# EAGLE schematic NS_ARM_Control_07_17_2017 (EAGLE 6.6.0)
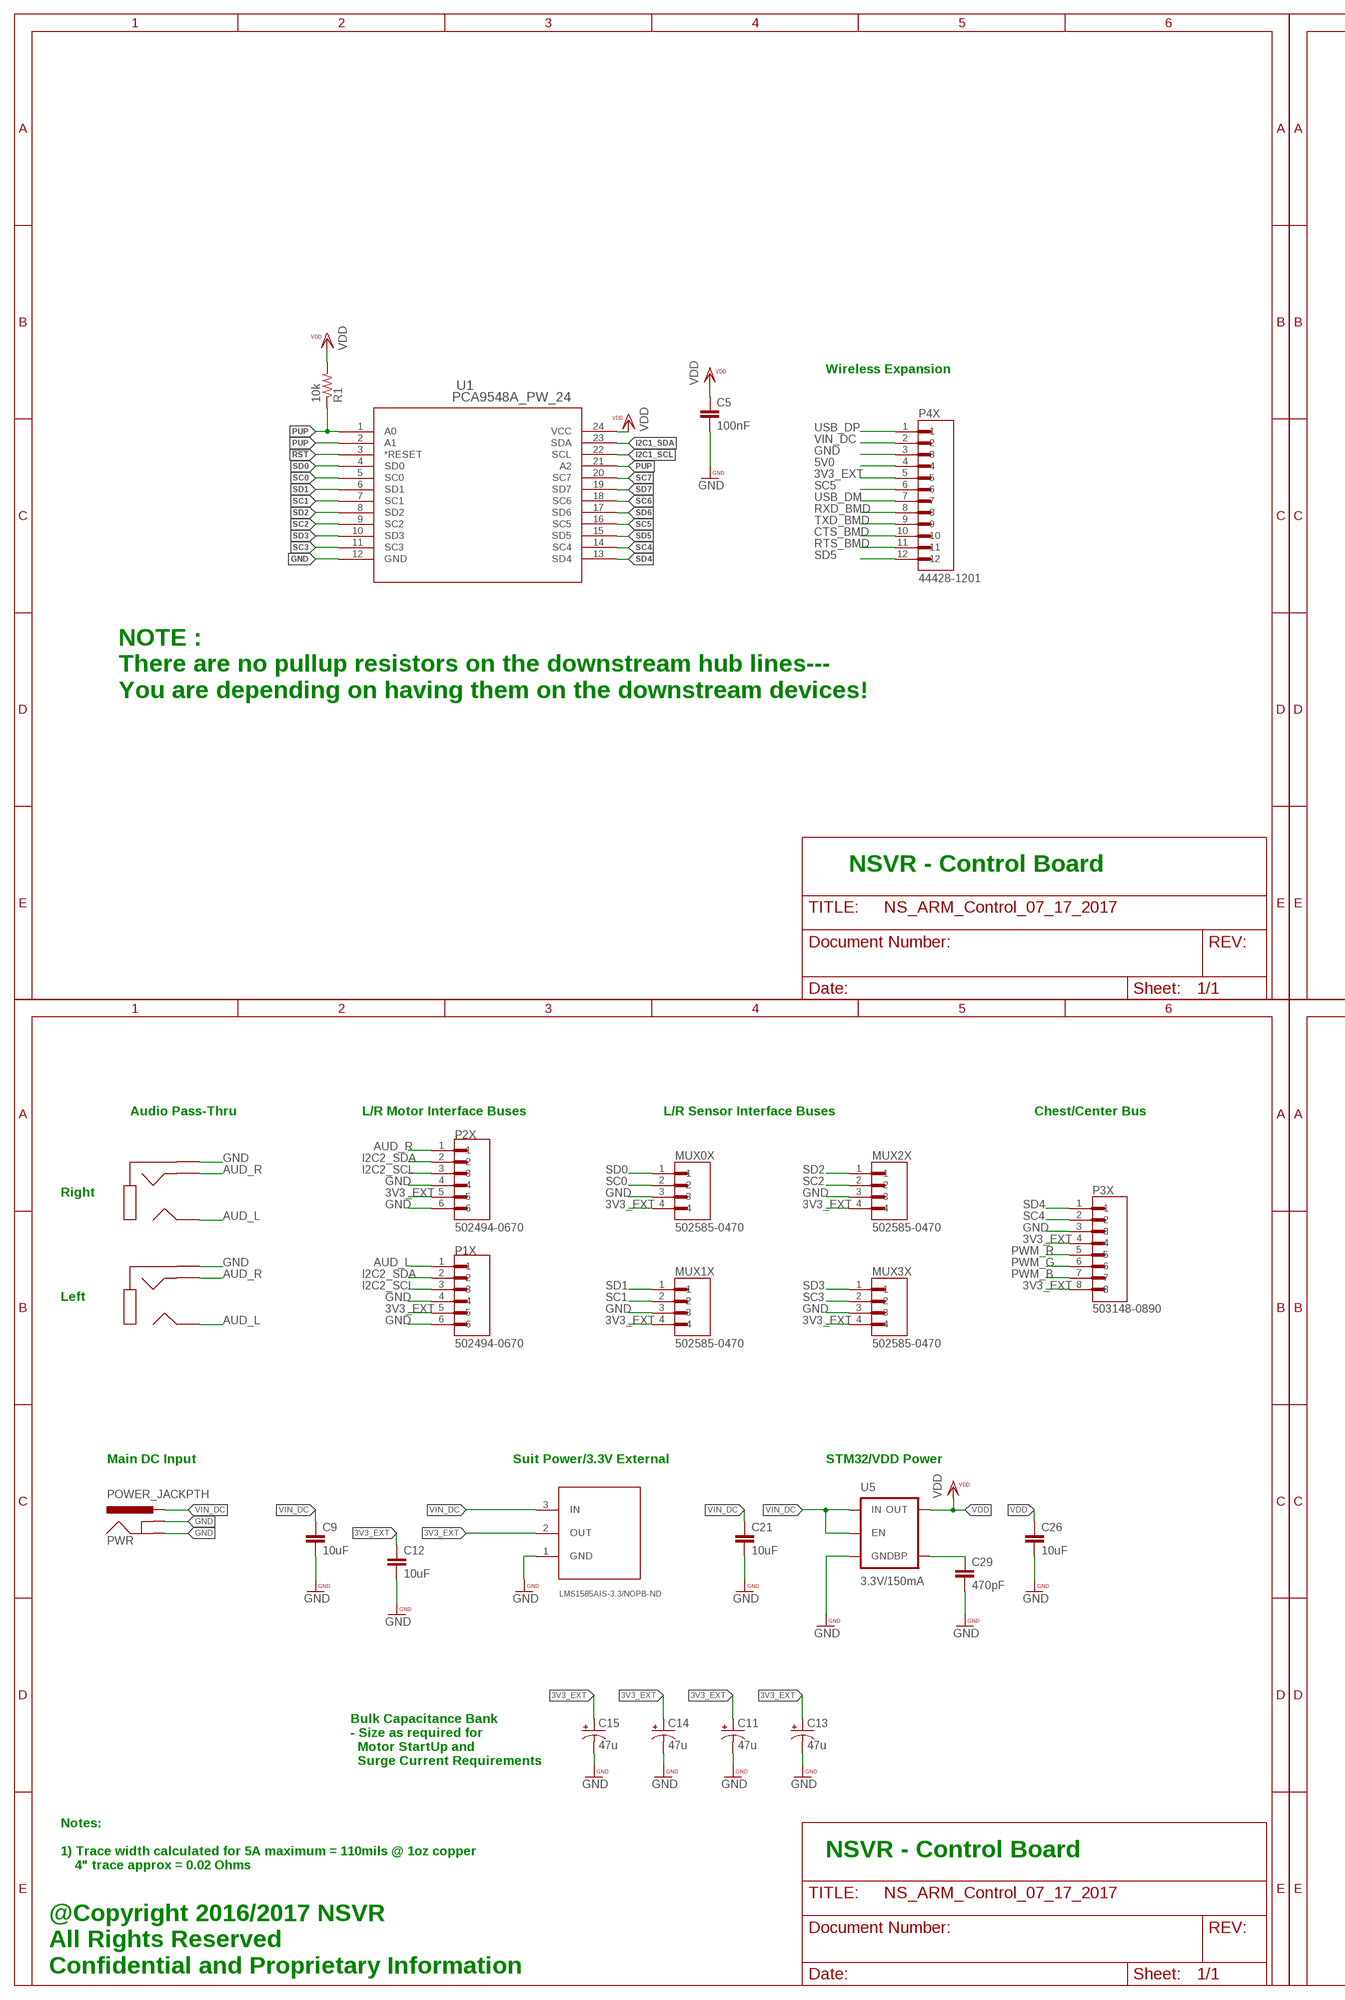
[diagram p0: schematic, sheet 1, part 1 of 2]
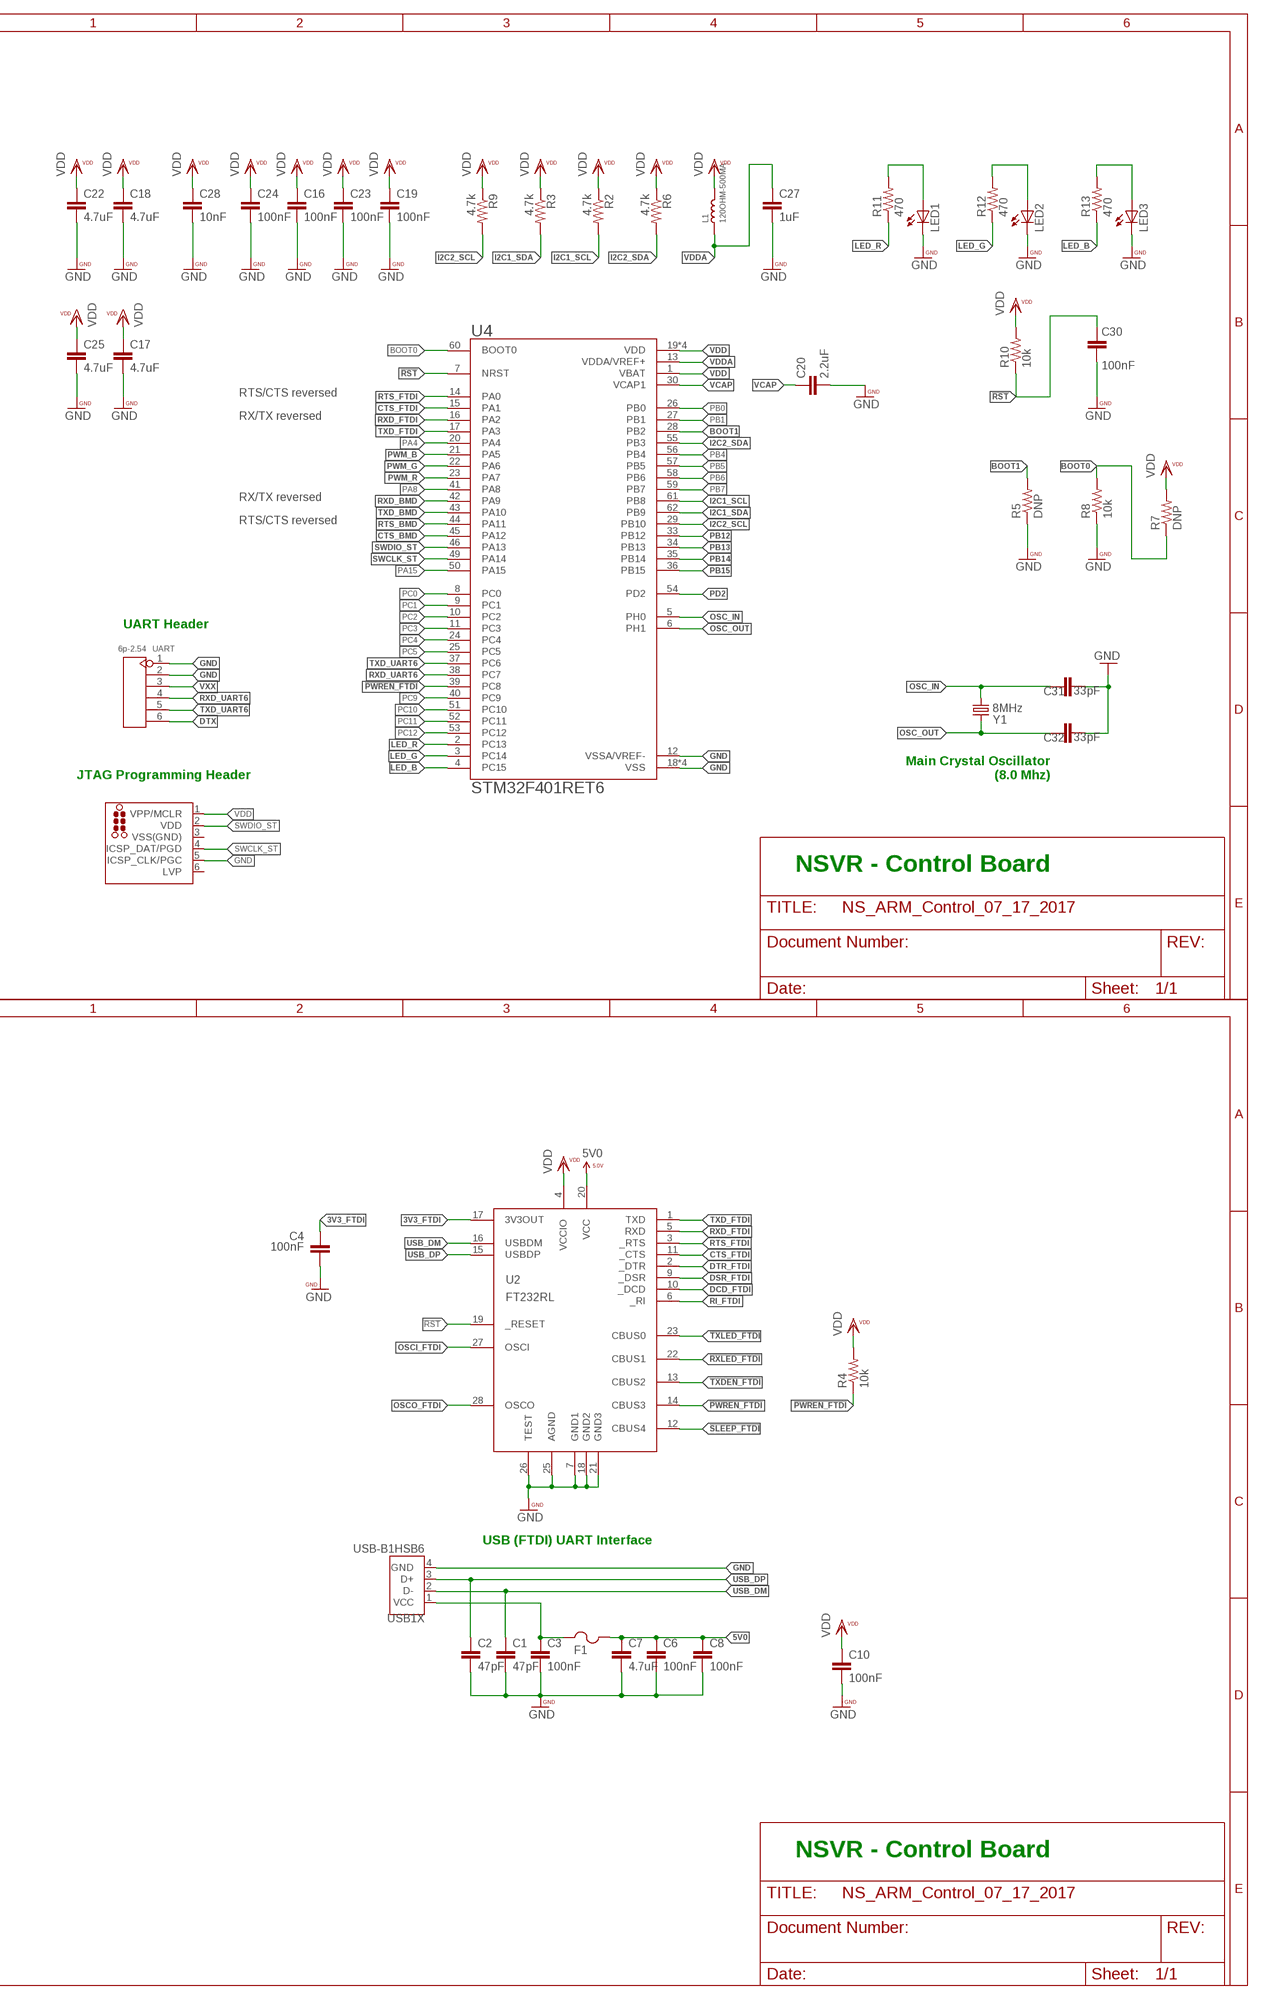
[diagram p1: schematic, sheet 1, part 2 of 2]

## Parts
C1  47pF  CAP0402-CAP  [0402-CAP]
C2  47pF  CAP0402-CAP  [0402-CAP]
C3  100nF  CAP0402-CAP  [0402-CAP]
C4  100nF  CAP0402-CAP  [0402-CAP]
C5  100nF  CAP0402-CAP  [0402-CAP]
C6  100nF  CAP0402-CAP  [0402-CAP]
C7  4.7uF  CAP0402-CAP  [0402-CAP]
C8  100nF  CAP0402-CAP  [0402-CAP]
C9  10uF  CAP0603-CAP  [0603-CAP]
C10  100nF  CAP0402-CAP  [0402-CAP]
C11  47u  CAP_POLD  [PANASONIC_D]
C12  10uF  CAP0603-CAP  [0603-CAP]
C13  47u  CAP_POLD  [PANASONIC_D]
C14  47u  CAP_POLD  [PANASONIC_D]
C15  47u  CAP_POLD  [PANASONIC_D]
C16  100nF  CAP0402-CAP  [0402-CAP]
C17  4.7uF  CAP0402-CAP  [0402-CAP]
C18  4.7uF  CAP0402-CAP  [0402-CAP]
C19  100nF  CAP0402-CAP  [0402-CAP]
C20  2.2uF  CAP0402-CAP  [0402-CAP]
C21  10uF  CAP0603-CAP  [0603-CAP]
C22  4.7uF  CAP0402-CAP  [0402-CAP]
C23  100nF  CAP0402-CAP  [0402-CAP]
C24  100nF  CAP0402-CAP  [0402-CAP]
C25  4.7uF  CAP0402-CAP  [0402-CAP]
C26  10uF  CAP0603-CAP  [0603-CAP]
C27  1uF  CAP0402-CAP  [0402-CAP]
C28  10nF  CAP0402-CAP  [0402-CAP]
C29  470pF  CAP0402-CAP  [0402-CAP]
C30  100nF  CAP0402-CAP  [0402-CAP]
C31  33pF  CAP0402-CAP  [0402-CAP]
C32  33pF  CAP0402-CAP  [0402-CAP]
F1  1206L050YR  [1206LSERIES]
J_ST  TC2030-MCP-NL  [TC2030-MCP-NL]
L1  120OHM-500MA  SMD-FERRITE-CHIP-120-OHM-500MA(0603)  [L0603]
LED1  LEDCHIP-LED0603  [CHIP-LED0603]
LED2  LEDCHIP-LED0603  [CHIP-LED0603]
LED3  LEDCHIP-LED0603  [CHIP-LED0603]
MUX0X  502585-0470  [MOLEX_502585-0470]
MUX1X  502585-0470  [MOLEX_502585-0470]
MUX2X  502585-0470  [MOLEX_502585-0470]
MUX3X  502585-0470  [MOLEX_502585-0470]
P1X  502494-0670  [MOLEX_502494-0670]
P2X  502494-0670  [MOLEX_502494-0670]
P3X  503148-0890  [MOLEX_503148-0890]
P4X  44428-1201  [MOLEX_44428-1201]
PJ1  SJ1-3513N  [SJ1-351XN]
PJ2  SJ1-3513N  [SJ1-351XN]
PWR  POWER_JACKPTH  [POWER_JACK_PTH]
R1  10k  RESISTOR0402-TYP  [EIA-0402]
R2  4.7k  RESISTOR0402-TYP  [EIA-0402]
R3  4.7k  RESISTOR0402-TYP  [EIA-0402]
R4  10k  RESISTOR0402-TYP  [EIA-0402]
R5  DNP  RESISTOR0402-TYP  [EIA-0402]
R6  4.7k  RESISTOR0402-TYP  [EIA-0402]
R7  DNP  RESISTOR0402-TYP  [EIA-0402]
R8  10k  RESISTOR0402-TYP  [EIA-0402]
R9  4.7k  RESISTOR0402-TYP  [EIA-0402]
R10  10k  RESISTOR0402-TYP  [EIA-0402]
R11  470  RESISTOR0402-TYP  [EIA-0402]
R12  470  RESISTOR0402-TYP  [EIA-0402]
R13  470  RESISTOR0402-TYP  [EIA-0402]
U1  PCA9548A_PW_24  [PW24]
U2  FT232RL  [SSOP28DB]
U3  LMS1585AIS-3.3/NOPB-ND  [TO254P1524X483-4N]
U4  STM32F401RET6  [QFP50P1200X1200X160-64N]
U5  3.3V/150mA  V_REG_MIC52053.3V  [SOT23-5]
UART  6p-2.54  DIP-BLACK-FEMALE-HEADER-VERT(6P-2.54)  [H6-2.54]
USB1X  USB-B1HSB6  [OST_USB-B1HSB6]
Y1  8MHz  CRYSTAL5X3  [CRYSTAL-SMD-5X3]

## Nets
3V3_EXT: C11.+ C12.1 C13.+ C14.+ C15.+ MUX0X.4 MUX1X.4 MUX2X.4 MUX3X.4 P1X.5 P2X.5 P3X.4 P3X.8 P4X.5 U3.2(OUT)
3V3_FTDI: C4.1 U2.17(3V3OUT)
5V0: C6.1 C7.1 C8.1 F1.2 P4X.4 U2.20(VCC)
!PWREN_FTDI: R4.1 U2.14(CBUS3) U4.39(PC8)
!RST: C30.1 R10.1 U1.3(*RESET) U2.19(_RESET) U4.7(NRST)
!RXLED_FTDI: U2.22(CBUS1)
!SLEEP_FTDI: U2.12(CBUS4)
!TXDEN_FTDI: U2.13(CBUS2)
!TXLED_FTDI: U2.23(CBUS0)
AUD_L: P1X.1 PJ1.2 PJ2.2
AUD_R: P2X.1 PJ1.3 PJ2.3
BOOT0: R7.1 R8.2 U4.60(BOOT0)
BOOT1: R5.2 U4.28(PB2)
CTS_BMD: P4X.10 U4.45(PA12)
CTS_FTDI: U2.11(_CTS) U4.15(PA1)
DCD_FTDI: U2.10(_DCD)
DSR_FTDI: U2.9(_DSR)
DTR_FTDI: U2.2(_DTR)
DTX: UART.6
GND: C1.2 C2.2 C3.2 C4.2 C5.2 C6.2 C7.2 C8.2 C9.2 C10.2 C11.- C12.2 C13.- C14.- C15.- C16.2 C17.2 C18.2 C19.2 C20.2 C21.2 C22.2 C23.2 C24.2 C25.2 C26.2 C27.2 C28.2 C29.2 C30.2 C31.1 C32.1 J_ST.5(ICSP_CLK/PGC) LED1.C LED2.C LED3.C MUX0X.3 MUX1X.3 MUX2X.3 MUX3X.3 P1X.4 P1X.6 P2X.4 P2X.6 P3X.3 P4X.3 PJ1.1 PJ2.1 PWR.GND PWR.GNDBREAK R5.1 R8.1 U1.12(GND) U2.7(GND1) U2.18(GND2) U2.21(GND3) U2.25(AGND) U2.26(TEST) U3.1(GND) U4.12(VSSA/VREF-) U4.18(VSS) U4.31(VSS) U4.47(VSS) U4.63(VSS) U5.2(GND) UART.1 UART.2 USB1X.4(GND)
I2C1_SCL: R2.2 U1.22(SCL) U4.61(PB8)
I2C1_SDA: R3.2 U1.23(SDA) U4.62(PB9)
I2C2_SCL: P1X.3 P2X.3 R9.2 U4.29(PB10)
I2C2_SDA: P1X.2 P2X.2 R6.2 U4.55(PB3)
LED1: LED1.A R11.2
LED2: LED2.A R12.2
LED3: LED3.A R13.2
LED_B: R13.1 U4.4(PC15)
LED_G: R12.1 U4.3(PC14)
LED_R: R11.1 U4.2(PC13)
N$7: C29.1 U5.4(BP)
OSC_IN: C31.2 U4.5(PH0) Y1.1
OSC_OUT: C32.2 U4.6(PH1) Y1.3
OSCI_FTDI: U2.27(OSCI)
OSCO_FTDI: U2.28(OSCO)
PA4: U4.20(PA4)
PA8: U4.41(PA8)
PA15: U4.50(PA15)
PB0: U4.26(PB0)
PB1: U4.27(PB1)
PB4: U4.56(PB4)
PB5: U4.57(PB5)
PB6: U4.58(PB6)
PB7: U4.59(PB7)
PB12: U4.33(PB12)
PB13: U4.34(PB13)
PB14: U4.35(PB14)
PB15: U4.36(PB15)
PC0: U4.8(PC0)
PC1: U4.9(PC1)
PC2: U4.10(PC2)
PC3: U4.11(PC3)
PC4: U4.24(PC4)
PC5: U4.25(PC5)
PC9: U4.40(PC9)
PC10: U4.51(PC10)
PC11: U4.52(PC11)
PC12: U4.53(PC12)
PD2: U4.54(PD2)
PUP: R1.1 U1.1(A0) U1.2(A1) U1.21(A2)
PWM_B: P3X.7 U4.21(PA5)
PWM_G: P3X.6 U4.22(PA6)
PWM_R: P3X.5 U4.23(PA7)
RI_FTDI: U2.6(_RI)
RTS_BMD: P4X.11 U4.44(PA11)
RTS_FTDI: U2.3(_RTS) U4.14(PA0)
RXD_BMD: P4X.8 U4.42(PA9)
RXD_FTDI: U2.5(RXD) U4.16(PA2)
RXD_UART6: U4.38(PC7) UART.4
SC0: MUX0X.2 U1.5(SC0)
SC1: MUX1X.2 U1.7(SC1)
SC2: MUX2X.2 U1.9(SC2)
SC3: MUX3X.2 U1.11(SC3)
SC4: P3X.2 U1.14(SC4)
SC5: P4X.6 U1.16(SC5)
SC6: U1.18(SC6)
SC7: U1.20(SC7)
SD0: MUX0X.1 U1.4(SD0)
SD1: MUX1X.1 U1.6(SD1)
SD2: MUX2X.1 U1.8(SD2)
SD3: MUX3X.1 U1.10(SD3)
SD4: P3X.1 U1.13(SD4)
SD5: P4X.12 U1.15(SD5)
SD6: U1.17(SD6)
SD7: U1.19(SD7)
SWCLK_ST: J_ST.4(ICSP_DAT/PGD) U4.49(PA14)
SWDIO_ST: J_ST.2(VDD) U4.46(PA13)
TXD_BMD: P4X.9 U4.43(PA10)
TXD_FTDI: U2.1(TXD) U4.17(PA3)
TXD_UART6: U4.37(PC6) UART.5
USB_DM: C1.1 P4X.7 U2.16(USBDM) USB1X.2(D-)
USB_DP: C2.1 P4X.1 U2.15(USBDP) USB1X.3(D+)
VBUS_IN: C3.1 F1.1 USB1X.1(VCC)
VCAP: C20.1 U4.30(VCAP1)
VDD: C5.1 C10.1 C16.1 C17.1 C18.1 C19.1 C22.1 C23.1 C24.1 C25.1 C26.1 C28.1 J_ST.1(VPP/MCLR) L1.2 R1.2 R2.1 R3.1 R4.2 R6.1 R7.2 R9.1 R10.2 U1.24(VCC) U2.4(VCCIO) U4.1(VBAT) U4.19(VDD) U4.32(VDD) U4.48(VDD) U4.64(VDD) U5.5(OUT)
VDDA: C27.1 L1.1 U4.13(VDDA/VREF+)
VIN_DC: C9.1 C21.1 P4X.2 PWR.PWR U3.3(IN) U5.1(IN) U5.3(EN)
VXX: UART.3
Unconnected: J_ST.6(LVP)

## Notes on the sheet
- Wireless Expansion
- RTS/CTS reversed
- RX/TX reversed
- RX/TX reversed
- RTS/CTS reversed
- UART Header
- NOTE :
  There are no pullup resistors on the downstream hub lines---
  You are depending on having them on the downstream devices!
- Main Crystal Oscillator
      (8.0 Mhz)
- JTAG Programming Header
- NSVR - Control Board | NSVR - Control Board
- Audio Pass-Thru | L/R Motor Interface Buses | L/R Sensor Interface Buses | Chest/Center Bus
- Right
- Left
- Main DC Input | Suit Power/3.3V External | STM32/VDD Power
- USB (FTDI) UART Interface
- Bulk Capacitance Bank
  - Size as required for
    Motor StartUp and
    Surge Current Requirements
- NSVR - Control Board | NSVR - Control Board
- Notes:
  
  1) Trace width calculated for 5A maximum = 110mils @ 1oz copper
      4" trace approx = 0.02 Ohms
- @Copyright 2016/2017 NSVR
  All Rights Reserved
  Confidential and Proprietary Information

## Power pins joined to a net without a drawn wire
VSS(GND): J_ST.3(VSS(GND))

## Library data of the parts
C1-C10 C12 C16-C32 = PatternAgents-ProtoPads:CAP: Capacitor Standard 0603 ceramic capacitor, and 0.1" leaded capacitor.
C11 C13-C15 = SparkFun-Capacitors:CAP_POL: Capacitor Polarized These are standard SMD and PTH capacitors. Normally 10uF, 47uF, and 100uF in electrolytic and tantalum varieties. Always verify the external diameter of the through hole cap, it varies with capacity, voltage, and manufacturer. The EIA devices should be standard.
F1 = 1206L050:1206L050YR; COPYRIGHT: Copyright C 2015 Accelerated Designs. All rights reserved; MANUFACTURER_PART_NUMBER: 1206L050YR; VENDOR: Littelfuse Inc
J_ST = tag-connect:TC2030: TAG-CONNECT ICSP Connector Manufacturer: Tag-Connect <http://www.tag-connect.com> Cable for easy In-Circuit Serial Programming. Designed for Microchip ICD2, suitable for many others. Two variants - one "with legs" (for hands-free fit on PCB) and another "without legs" for quick programming. PAD Description 1 MCLR/Vpp 2 Vdd 3 GND 4 PGD (ISPDAT) 5 PGC (ISPCLK) 6 nc (used for LVP) ©2009 ROFA.cz - modified and updated by Robert Darlington ‹rdarlington@gmail.com›
L1 = Seeed-Inductor-2016:SMD-FERRITE-CHIP-120-OHM-500MA(0603): 303030001; MPN: BLM18AG121SN1D
LED1-LED3 = led:LED: LED OSRAM: - CHIPLED LG R971, LG N971, LY N971, LG Q971, LY Q971, LO R971, LY R971 LH N974, LH R974 LS Q976, LO Q976, LY Q976 LO Q996 - Hyper CHIPLED LW Q18S LB Q993, LB Q99A, LB R99A - SideLED LS A670, LO A670, LY A670, LG A670, LP A670 LB A673, LV A673, LT A673, LW A673 LH A674 LY A675 LS A676, LA A676, LO A676, LY A676, LW A676 LS A679, LY A679, LG A679 - Hyper Micro SIDELED® LS Y876, LA Y876, LO Y876, LY Y876 LT Y87S - SmartLED LW L88C, LW L88S LB L89C, LB L89S, LG L890 LS L89K, LO L89K, LY L89K LS L896, LA L896, LO L896, LY L896 - TOPLED LS T670, LO T670, LY T670, LG T670, LP T670 LSG T670, LSP T670, LSY T670, LOP T670, LYG T670 LG T671, LOG T671, LSG T671 LB T673, LV T673, LT T673, LW T673 LH T674 LS T676, LA T676, LO T676, LY T676, LB T676, LH T676, LSB T676, LW T676 LB T67C, LV T67C, LT T67C, LS T67K, LO T67K, LY T67K, LW E67C LS E67B, LA E67B, LO E67B, LY E67B, LB E67C, LV E67C, LT E67C LW T67C LS T679, LY T679, LG T679 LS T770, LO T770, LY T770, LG T770, LP T770 LB T773, LV T773, LT T773, LW T773 LH T774 LS E675, LA E675, LY E675, LS T675 LS T776, LA T776, LO T776, LY T776, LB T776 LHGB T686 LT T68C, LB T68C - Hyper Mini TOPLED® LB M676 - Mini TOPLED Santana® LG M470 LS M47K, LO M47K, LY M47K Source: http://www.osram.convergy.de LUXEON: - LUMILED® LXK2-PW12-R00, LXK2-PW12-S00, LXK2-PW14-U00, LXK2-PW14-V00 LXK2-PM12-R00, LXK2-PM12-S00, LXK2-PM14-U00 LXK2-PE12-Q00, LXK2-PE12-R00, LXK2-PE12-S00, LXK2-PE14-T00, LXK2-PE14-U00 LXK2-PB12-K00, LXK2-PB12-L00, LXK2-PB12-M00, LXK2-PB14-N00, LXK2-PB14-P00, LXK2-PB14-Q00 LXK2-PR12-L00, LXK2-PR12-M00, LXK2-PR14-Q00, LXK2-PR14-R00 LXK2-PD12-Q00, LXK2-PD12-R00, LXK2-PD12-S00 LXK2-PH12-R00, LXK2-PH12-S00 LXK2-PL12-P00, LXK2-PL12-Q00, LXK2-PL12-R00 Source: www.luxeon.com KINGBRIGHT: KA-3528ASYC Source: www.kingbright.com
MUX0X MUX1X MUX2X MUX3X = 502585-0470:502585-0470: 1.50mm Pitch CLIK-Mate™ Wire-to-Board PCB Receptacle, Single Row, Right Angle, 4 Circuits; AVAILABILITY: Good; DESCRIPTION: 1.50mm Pitch CLIK-Mate™ Wire-to-Board PCB Receptacle, Single Row, Right Angle, 4 Circuits; MF: Molex; MP: 502585-0470; PACKAGE: None; PRICE: 0.44 USD
P1X P2X = 502494-0670:502494-0670: 2.00mm Pitch CLIK-Mate™ Wire-to-Board PCB Receptacle, Single Row, Right Angle, 6 Circuits; AVAILABILITY: Good; DESCRIPTION: 2.00mm Pitch CLIK-Mate™ Wire-to-Board PCB Receptacle, Single Row, Right Angle, 6 Circuits; MF: Molex; MP: 502494-0670; PACKAGE: None; PRICE: 0.53 USD
P3X = 503148-0890:503148-0890: 1.5wb Dual r/a Embs Tape Pkg 8p; AVAILABILITY: Good; DESCRIPTION: 1.5wb Dual r/a Embs Tape Pkg 8p; MF: Molex; MP: 503148-0890; PACKAGE: None; PRICE: 1.11 USD
P4X = 44428-1201:44428-1201: Conn Wire to Board HDR 12 POS 3mm Solder RA Thru-Hole Micro-Fit 3.0 BMI? Tray; AVAILABILITY: Good; DESCRIPTION: Conn Wire to Board HDR 12 POS 3mm Solder RA Thru-Hole Micro-Fit 3.0 BMI? Tray; MF: Molex; MP: 44428-1201; PACKAGE: None; PRICE: 2.39 USD
PJ1 PJ2 = audio_mux:SJ1-3513N
PWR = SparkFun-Connectors:POWER_JACK: Power Jack This is the standard 5.5mm barrel jack for power. The PTH is the most common, proven, reliable, footprint. The Slot footprint only works if the mill layer is transmitted to the PCB fab house so be warned. Mating wall wart : TOL-00298 (and others); PROD_ID: CONN-08197
R1-R13 = PatternAgents-ProtoPads:RESISTOR: Resistor Basic schematic elements and footprints for 0603, 1206, and PTH resistors.
U1 = PCA9548A_PW_124:PCA9548A_PW_24; DATASHEETURL: http://www.ti.com/lit/gpn/PCA9548A; DESCRIPTION: 8-Channel I2C Switch With Reset; FAMILY_NAME: I2C MULTIPLEXER, SWITCH; GENERIC_PART_NUMBER: PCA9548A; INDUSTRY_STD_PKG_TYPE: TSSOP; MANUFACTURER: Texas Instruments; MANUFACTURER_PART_NUMBER: pca9548a_pw_24; PACKAGE_DESIGNATOR: PW; PIN_COUNT: 24; VENDOR: Texas Instruments
U2 = ftdichip-3:FT232RL: USB UART 4th Generation USB UART (USB <-> Serial) Controller
U3 = TO254P1524X483-4N:LMS1585AIS-3.3/NOPB-ND
U4 = STM32F401RET6:STM32F401RET6: MCU 32-Bit STM32 ARM Cortex M4 RISC 512KB Flash 1.8V/2.5V/3.3V 64-Pin LQFP Tray; AVAILABILITY: Good; DESCRIPTION: MCU 32-Bit STM32 ARM Cortex M4 RISC 512KB Flash 1.8V/2.5V/3.3V 64-Pin LQFP Tray; MF: STMicroelectronics; MP: STM32F401RET6; PACKAGE: LQFP-64 STMicroelectronics; PRICE: 4.74 USD
U5 = SparkFun-PowerIC:V_REG_MIC5205: V_REG MIC5205 Standard 3.3V, 5V, and Adjustable 150mA LDO voltage regulator in SOT-23 layout. Micrel part MIC5205. BP (by-pass) pin is used to lower output noise with 470pF cap, may be left open. On the adjustable version BP is used to set output.; PROD_ID: VREG-00822
UART = Seeed-Connector -2016:DIP-BLACK-FEMALE-HEADER-VERT(6P-2.54): 320030060; MPN: F185-1106A1BSYC1
USB1X = USB-B1HSB6:USB-B1HSB6: Conn Usb Type b r/a Black; AVAILABILITY: Warning; DESCRIPTION: Conn Usb Type b r/a Black; MF: On Shore Technology; MP: USB-B1HSB6; PACKAGE: None; PRICE: 0.42 USD
Y1 = SparkFun2:CRYSTAL: Crystals Various standard crystals. Proven footprints. Spark Fun Electronics SKU : COM-00534

## Net classes
1 vcc: width 0.254 mm